# EAGLE design ControlBoard-v1.0 (EAGLE 8.5.2)
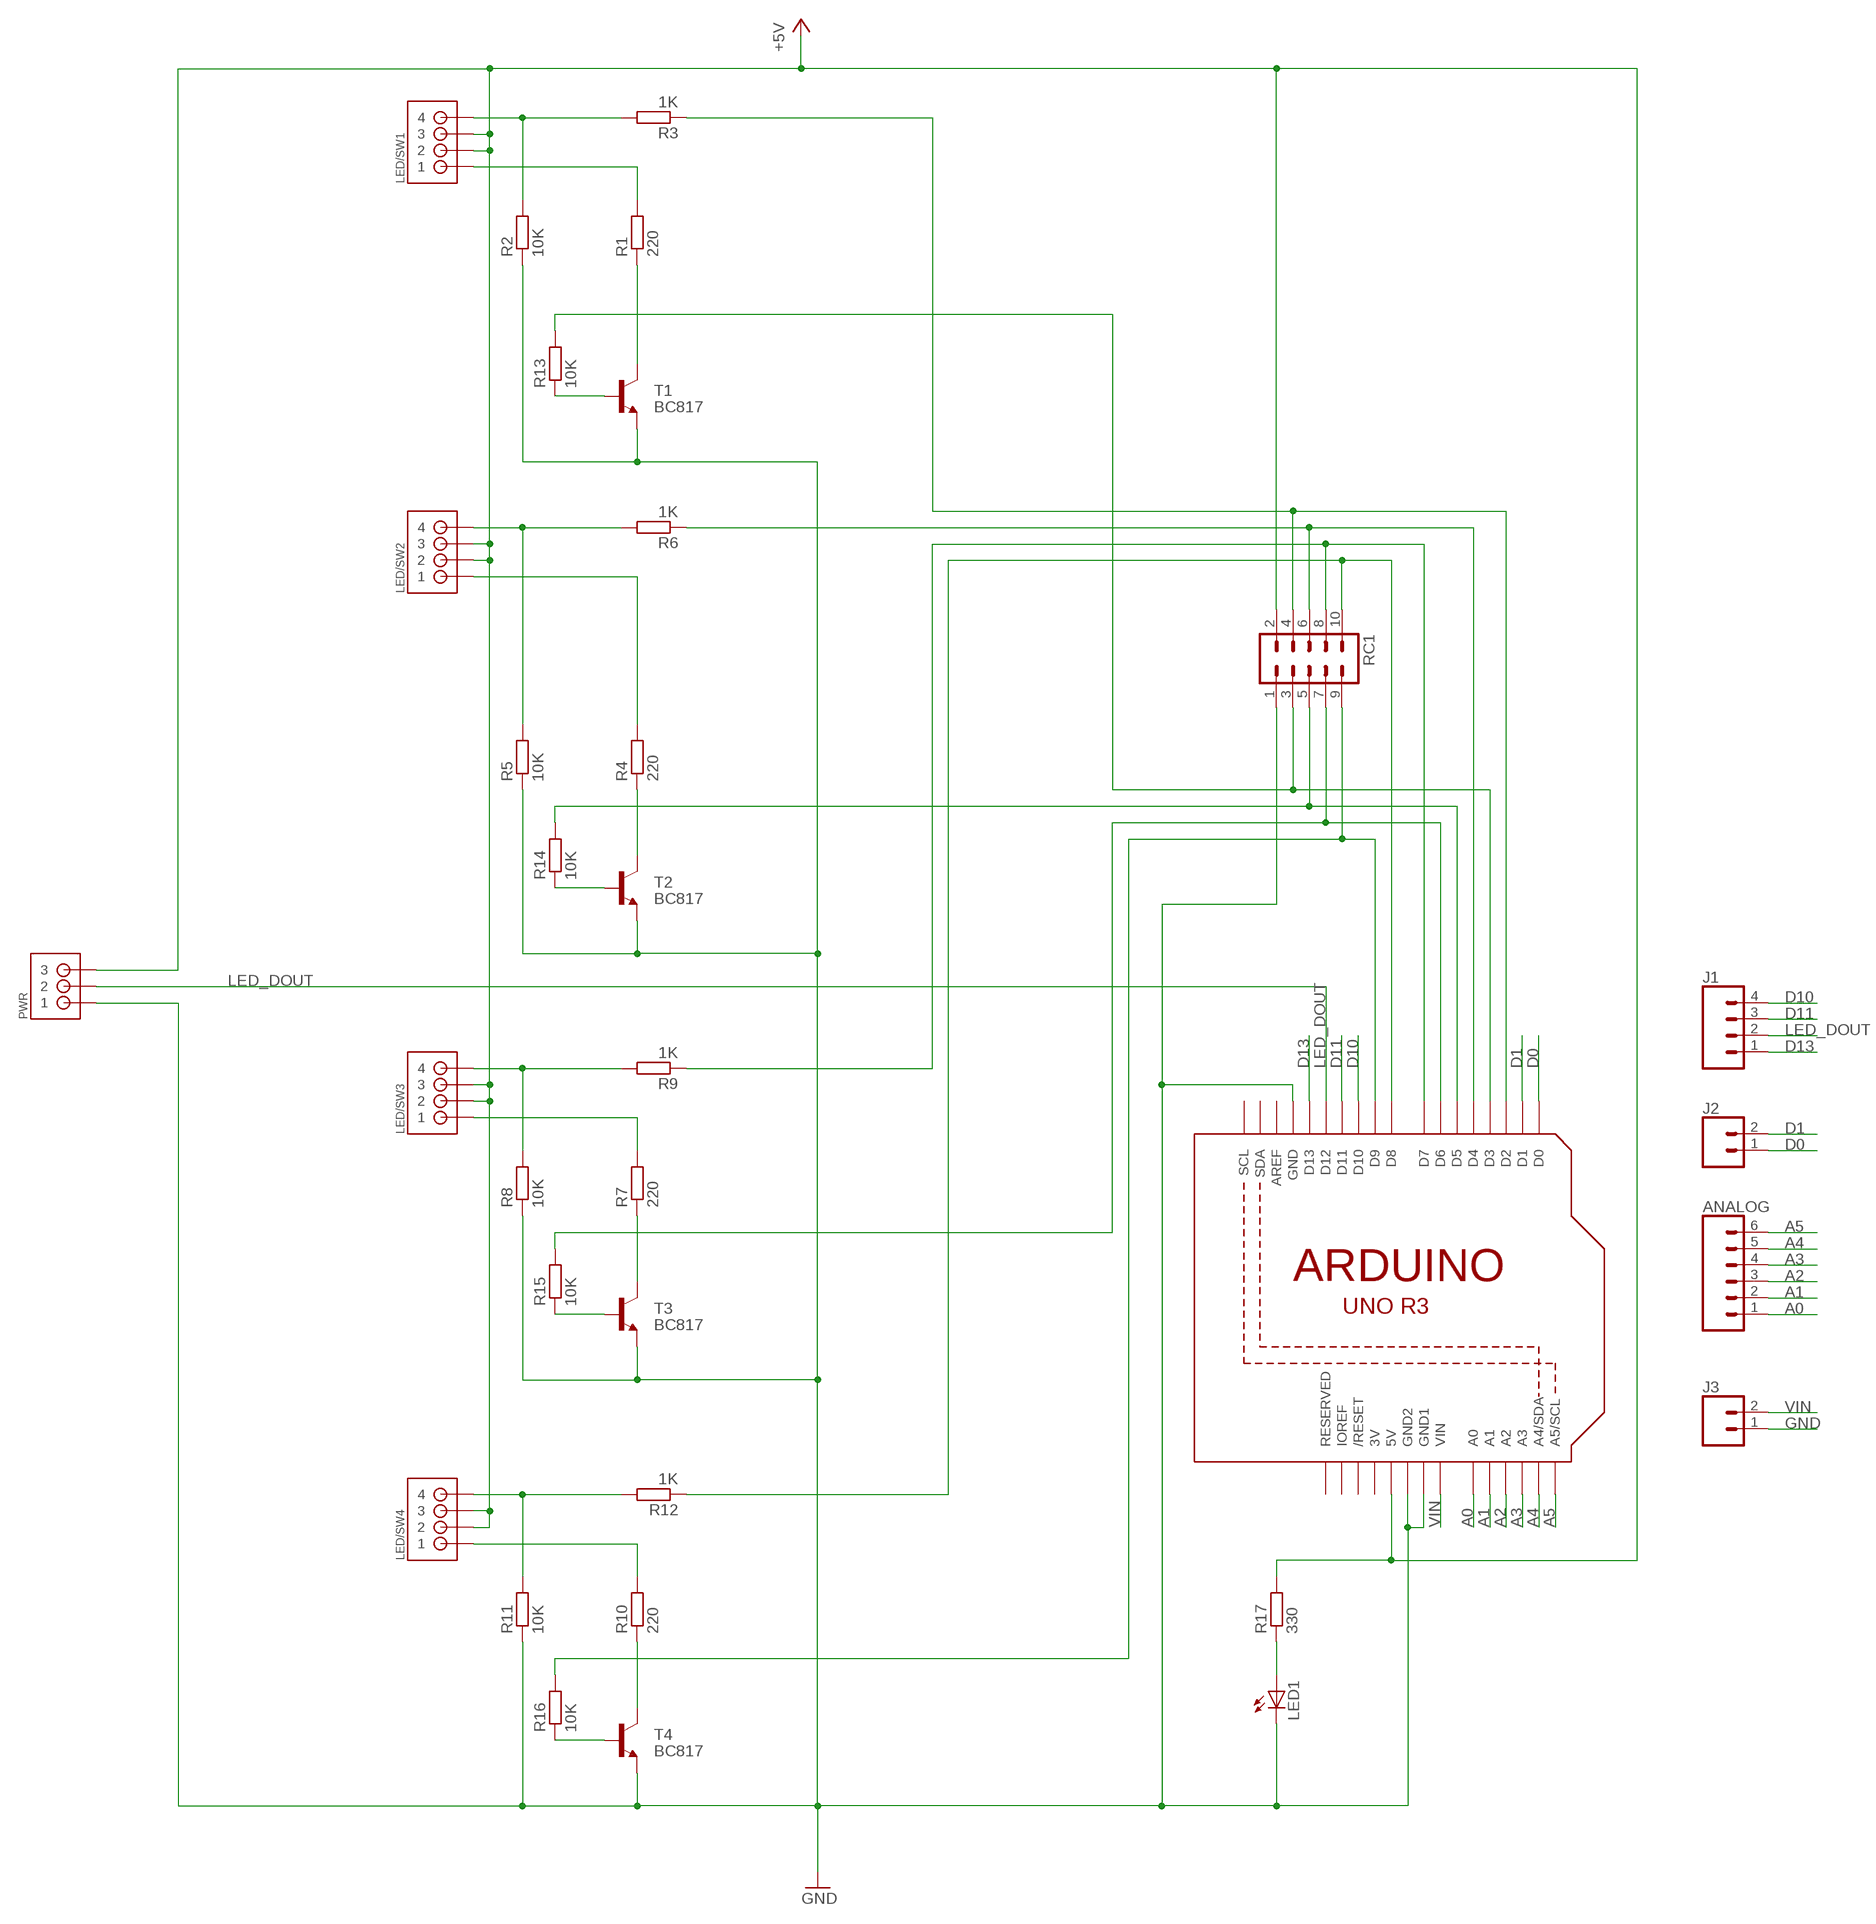
[diagram p0: schematic, sheet 1]

## Parts
ANALOG  CONN_06SILK_FEMALE_PTH  [1X06]
J1  CONN_04  [1X04]
J2  CONN_02  [1X02]
J3  CONN_02  [1X02]
LED1  LEDCHIPLED_0805  [CHIPLED_0805]
LED/SW1  JST-XA-04-PIN  [JST-XA-04]
LED/SW2  JST-XA-04-PIN  [JST-XA-04]
LED/SW3  JST-XA-04-PIN  [JST-XA-04]
LED/SW4  JST-XA-04-PIN  [JST-XA-04]
PWR  JST-XA-03-PIN  [JST-XA-03]
R1  220  RESISTORR0805  [R0805]
R2  10K  RESISTORR0805  [R0805]
R3  1K  RESISTORR0805  [R0805]
R4  220  RESISTORR0805  [R0805]
R5  10K  RESISTORR0805  [R0805]
R6  1K  RESISTORR0805  [R0805]
R7  220  RESISTORR0805  [R0805]
R8  10K  RESISTORR0805  [R0805]
R9  1K  RESISTORR0805  [R0805]
R10  220  RESISTORR0805  [R0805]
R11  10K  RESISTORR0805  [R0805]
R12  1K  RESISTORR0805  [R0805]
R13  10K  RESISTORR0805  [R0805]
R14  10K  RESISTORR0805  [R0805]
R15  10K  RESISTORR0805  [R0805]
R16  10K  RESISTORR0805  [R0805]
R17  330  RESISTORR0805  [R0805]
RC1  ML10  [ML10]
T1  BC817  [SOT23]
T2  BC817  [SOT23]
T3  BC817  [SOT23]
T4  BC817  [SOT23]
U1  ARDUINO-SHIELDLET  [ARDUINOR3-PINS]

## Nets
+5V: LED/SW1.2 LED/SW1.3 LED/SW2.2 LED/SW2.3 LED/SW3.2 LED/SW3.3 LED/SW4.2 LED/SW4.3 PWR.3 R17.2 RC1.2 U1.5V
A0: ANALOG.1 U1.A0
A1: ANALOG.2 U1.A1
A2: ANALOG.3 U1.A2
A3: ANALOG.4 U1.A3
A4: ANALOG.5 U1.A4(A4/SDA)
A5: ANALOG.6 U1.A5(A5/SCL)
D0: J2.1 U1.D0
D1: J2.2 U1.D1
D10: J1.4 U1.D10
D11: J1.3 U1.D11
D13: J1.1 U1.D13
GND: J3.1 LED1.C PWR.1 R2.1 R5.1 R8.1 R11.1 RC1.1 T1.2(E) T2.2(E) T3.2(E) T4.2(E) U1.GND U1.GND1 U1.GND2
LED_DOUT: J1.2 PWR.2 U1.D12
N$1: LED/SW1.1 R1.2
N$2: R1.1 T1.3(C)
N$3: LED/SW1.4 R2.2 R3.2
N$4: R3.1 RC1.4 U1.D2
N$5: R13.1 T1.1(B)
N$6: LED/SW2.1 R4.2
N$7: R4.1 T2.3(C)
N$8: LED/SW2.4 R5.2 R6.2
N$9: R6.1 RC1.6 U1.D4
N$10: R14.2 RC1.5 U1.D5
N$11: LED/SW3.1 R7.2
N$12: R7.1 T3.3(C)
N$13: LED/SW3.4 R8.2 R9.2
N$14: R9.1 RC1.8 U1.D7
N$15: R15.2 RC1.7 U1.D6
N$16: LED/SW4.1 R10.2
N$17: R10.1 T4.3(C)
N$18: LED/SW4.4 R11.2 R12.2
N$19: R12.1 RC1.10 U1.D8
N$20: R16.2 RC1.9 U1.D9
N$22: R14.1 T2.1(B)
N$23: R15.1 T3.1(B)
N$24: R16.1 T4.1(B)
N$26: LED1.A R17.1
N$27: R13.2 RC1.3 U1.D3
VIN: J3.2 U1.VIN
Unconnected: U1.AREF U1.IOREF U1.RESERVED U1.RESET(/RESET) U1.SCL U1.SDA

## Power pins joined to a net without a drawn wire
3V: U1.3V

## Library data of the parts
ANALOG = SparkFun-Connectors:CONN_06: Multi connection point. Often used as Generic Header-pin footprint for 0.1 inch spaced/style header connections On any of the 0.1 inch spaced packages, you can populate with these: Break Away Headers - Straight <https://www.sparkfun.com/products/116> (PRT-00116) Break Away Male Headers - Right Angle <https://www.sparkfun.com/products/553> (PRT-00553) Female Headers <https://www.sparkfun.com/products/115> (PRT-00115) Break Away Headers - Machine Pin <https://www.sparkfun.com/products/117> (PRT-00117) Break Away Female Headers - Swiss Machine Pin <https://www.sparkfun.com/products/743> (PRT-00743) Arduino Stackable Header - 6 Pin <https://www.sparkfun.com/products/9280> (PRT-09280) For SCREWTERMINALS and SPRING TERMINALS visit here: Screw Terimnals on SparkFun.com <https://www.sparkfun.com/search/results?term=Screw+Terminals> (5mm/3.5mm/2.54mm spacing) This device is also useful as a general connection point to wire up your design to another part of your project. Our various solder wires solder well into these plated through hole pads. Hook-Up Wire - Assortment (Stranded, 22 AWG) <https://www.sparkfun.com/products/11375> (PRT-11375) Hook-Up Wire - Assortment (Solid Core, 22 AWG) <https://www.sparkfun.com/products/11367> (PRT-11367) View the entire wire category on our website here <https://www.sparkfun.com/categories/141>; PROD_ID: CONN-08437
J1 = SparkFun-Connectors:CONN_04: Multi connection point. Often used as Generic Header-pin footprint for 0.1 inch spaced/style header connections On any of the 0.1 inch spaced packages, you can populate with these: Break Away Headers - Straight <https://www.sparkfun.com/products/116> (PRT-00116) Break Away Male Headers - Right Angle <https://www.sparkfun.com/products/553> (PRT-00553) Female Headers <https://www.sparkfun.com/products/115> (PRT-00115) Break Away Headers - Machine Pin <https://www.sparkfun.com/products/117> (PRT-00117) Break Away Female Headers - Swiss Machine Pin <https://www.sparkfun.com/products/743> (PRT-00743) For SCREWTERMINALS and SPRING TERMINALS visit here: Screw Terimnals on SparkFun.com <https://www.sparkfun.com/search/results?term=Screw+Terminals> (5mm/3.5mm/2.54mm spacing) This device is also useful as a general connection point to wire up your design to another part of your project. Our various solder wires solder well into these plated through hole pads. Hook-Up Wire - Assortment (Stranded, 22 AWG) <https://www.sparkfun.com/products/11375> (PRT-11375) Hook-Up Wire - Assortment (Solid Core, 22 AWG) <https://www.sparkfun.com/products/11367> (PRT-11367) View the entire wire category on our website here <https://www.sparkfun.com/categories/141> Special notes: Molex polarized connector foot print use with SKU : PRT-08231 with associated crimp pins and housings. 1MM SMD Version SKU: PRT-10208; PROD_ID: CONN-09696
J2 J3 = SparkFun-Connectors:CONN_02: Multi connection point. Often used as Generic Header-pin footprint for 0.1 inch spaced/style header connections On any of the 0.1 inch spaced packages, you can populate with these: Break Away Headers - Straight <https://www.sparkfun.com/products/116> (PRT-00116) Break Away Male Headers - Right Angle <https://www.sparkfun.com/products/553> (PRT-00553) Female Headers <https://www.sparkfun.com/products/115> (PRT-00115) Break Away Headers - Machine Pin <https://www.sparkfun.com/products/117> (PRT-00117) Break Away Female Headers - Swiss Machine Pin <https://www.sparkfun.com/products/743> (PRT-00743) For SCREWTERMINALS and SPRING TERMINALS visit here: Screw Terimnals on SparkFun.com <https://www.sparkfun.com/search/results?term=Screw+Terminals> (5mm/3.5mm/2.54mm spacing) This device is also useful as a general connection point to wire up your design to another part of your project. Our various solder wires solder well into these plated through hole pads. Hook-Up Wire - Assortment (Stranded, 22 AWG) <https://www.sparkfun.com/products/11375> (PRT-11375) Hook-Up Wire - Assortment (Solid Core, 22 AWG) <https://www.sparkfun.com/products/11367> (PRT-11367) View the entire wire category on our website here <https://www.sparkfun.com/categories/141> Special notes: Molex polarized connector foot print use with: PRT-08233 with associated crimp pins and housings. 2.54_SCREWTERM for use with PRT-10571. 3.5mm Screw Terminal footprints for PRT-08084 5mm Screw Terminal footprints for use with PRT-08432
LED1 = adafruit:LED: LED OSRAM: - CHIPLED LG R971, LG N971, LY N971, LG Q971, LY Q971, LO R971, LY R971 LH N974, LH R974 LS Q976, LO Q976, LY Q976 LO Q996 - Hyper CHIPLED LW Q18S LB Q993, LB Q99A, LB R99A - SideLED LS A670, LO A670, LY A670, LG A670, LP A670 LB A673, LV A673, LT A673, LW A673 LH A674 LY A675 LS A676, LA A676, LO A676, LY A676, LW A676 LS A679, LY A679, LG A679 - Hyper Micro SIDELED® LS Y876, LA Y876, LO Y876, LY Y876 LT Y87S - SmartLED LW L88C, LW L88S LB L89C, LB L89S, LG L890 LS L89K, LO L89K, LY L89K LS L896, LA L896, LO L896, LY L896 - TOPLED LS T670, LO T670, LY T670, LG T670, LP T670 LSG T670, LSP T670, LSY T670, LOP T670, LYG T670 LG T671, LOG T671, LSG T671 LB T673, LV T673, LT T673, LW T673 LH T674 LS T676, LA T676, LO T676, LY T676, LB T676, LH T676, LSB T676, LW T676 LB T67C, LV T67C, LT T67C, LS T67K, LO T67K, LY T67K, LW E67C LS E67B, LA E67B, LO E67B, LY E67B, LB E67C, LV E67C, LT E67C LW T67C LS T679, LY T679, LG T679 LS T770, LO T770, LY T770, LG T770, LP T770 LB T773, LV T773, LT T773, LW T773 LH T774 LS E675, LA E675, LY E675, LS T675 LS T776, LA T776, LO T776, LY T776, LB T776 LHGB T686 LT T68C, LB T68C - Hyper Mini TOPLED® LB M676 - Mini TOPLED Santana® LG M470 LS M47K, LO M47K, LY M47K Source: http://www.osram.convergy.de/
LED/SW1-LED/SW4 = abw:JST-XA-04-PIN
PWR = abw:JST-XA-03-PIN: JST XA Connector 3 Pin Wire to board connector. Pitch: 2.54 mm, (0.100") Number of pins: 3
R1-R17 = abw:RESISTOR: RESISTOR, European symbol
RC1 = con-harting-ml:ML10: HARTING; OC_FARNELL: unknown; OC_NEWARK: unknown
T1-T4 = abw:BC817: General purpose NPN transistor SMD
U1 = abw:ARDUINO-SHIELDLET

## Board
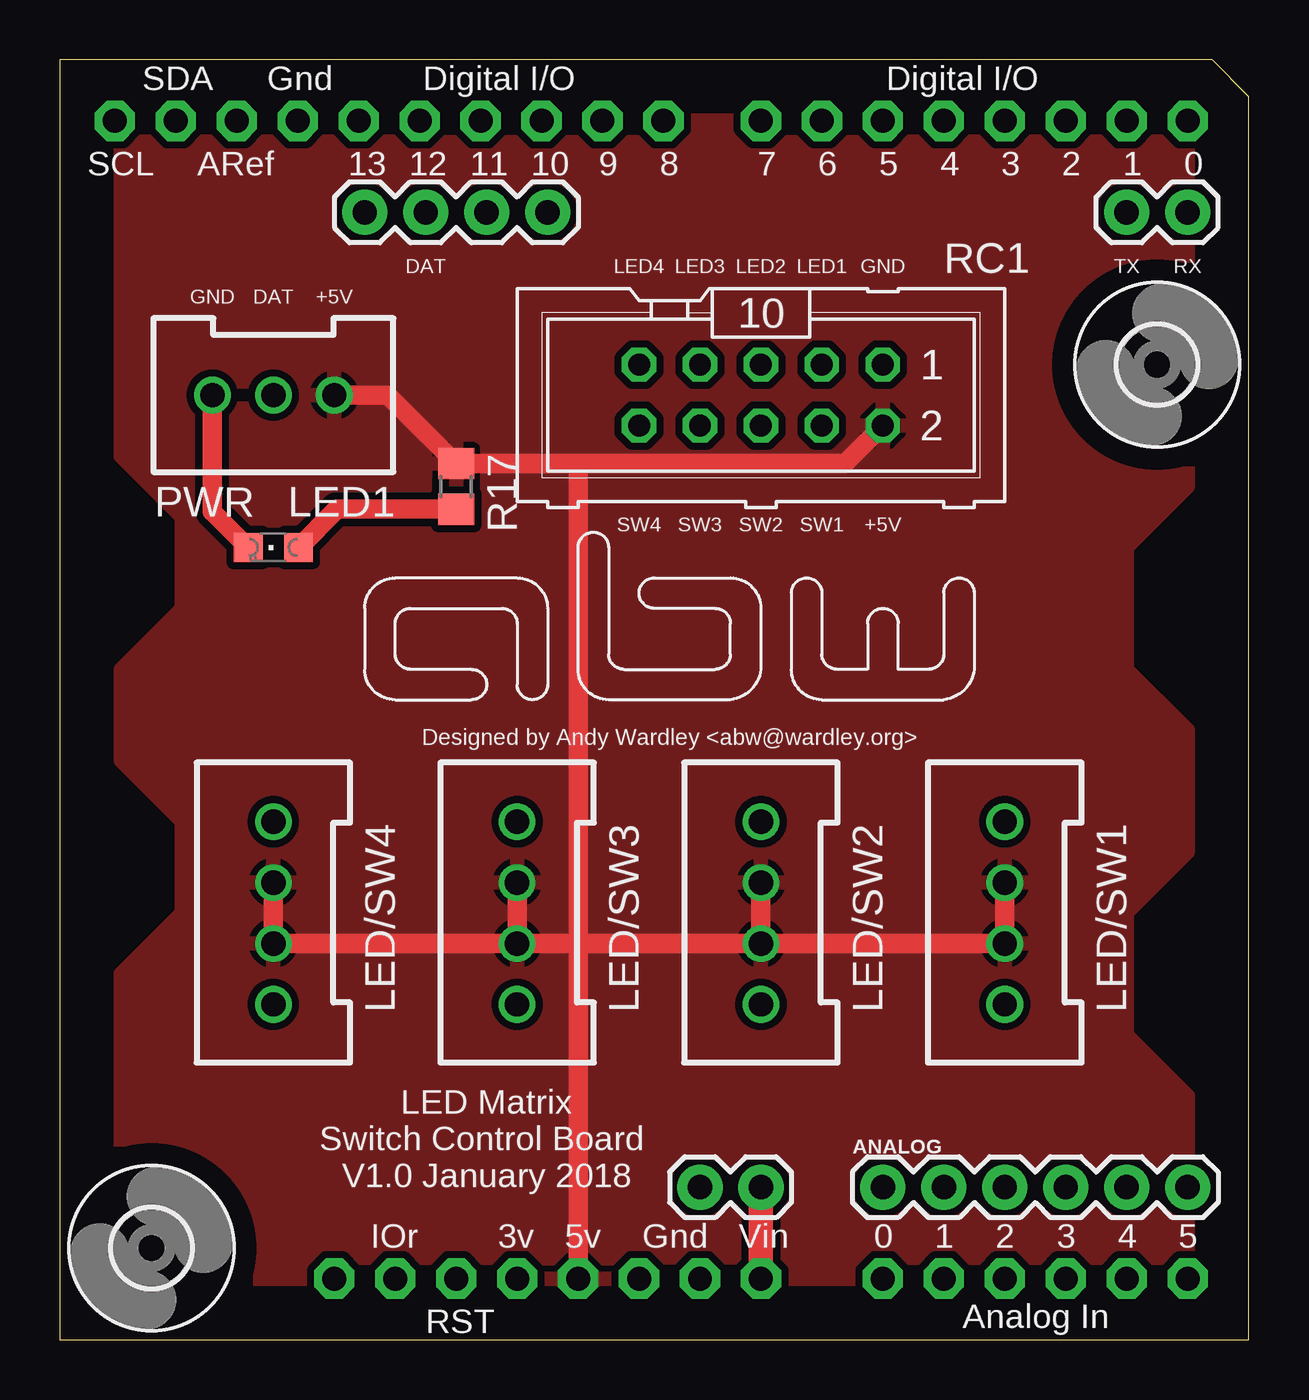
[diagram p1: board, top side]
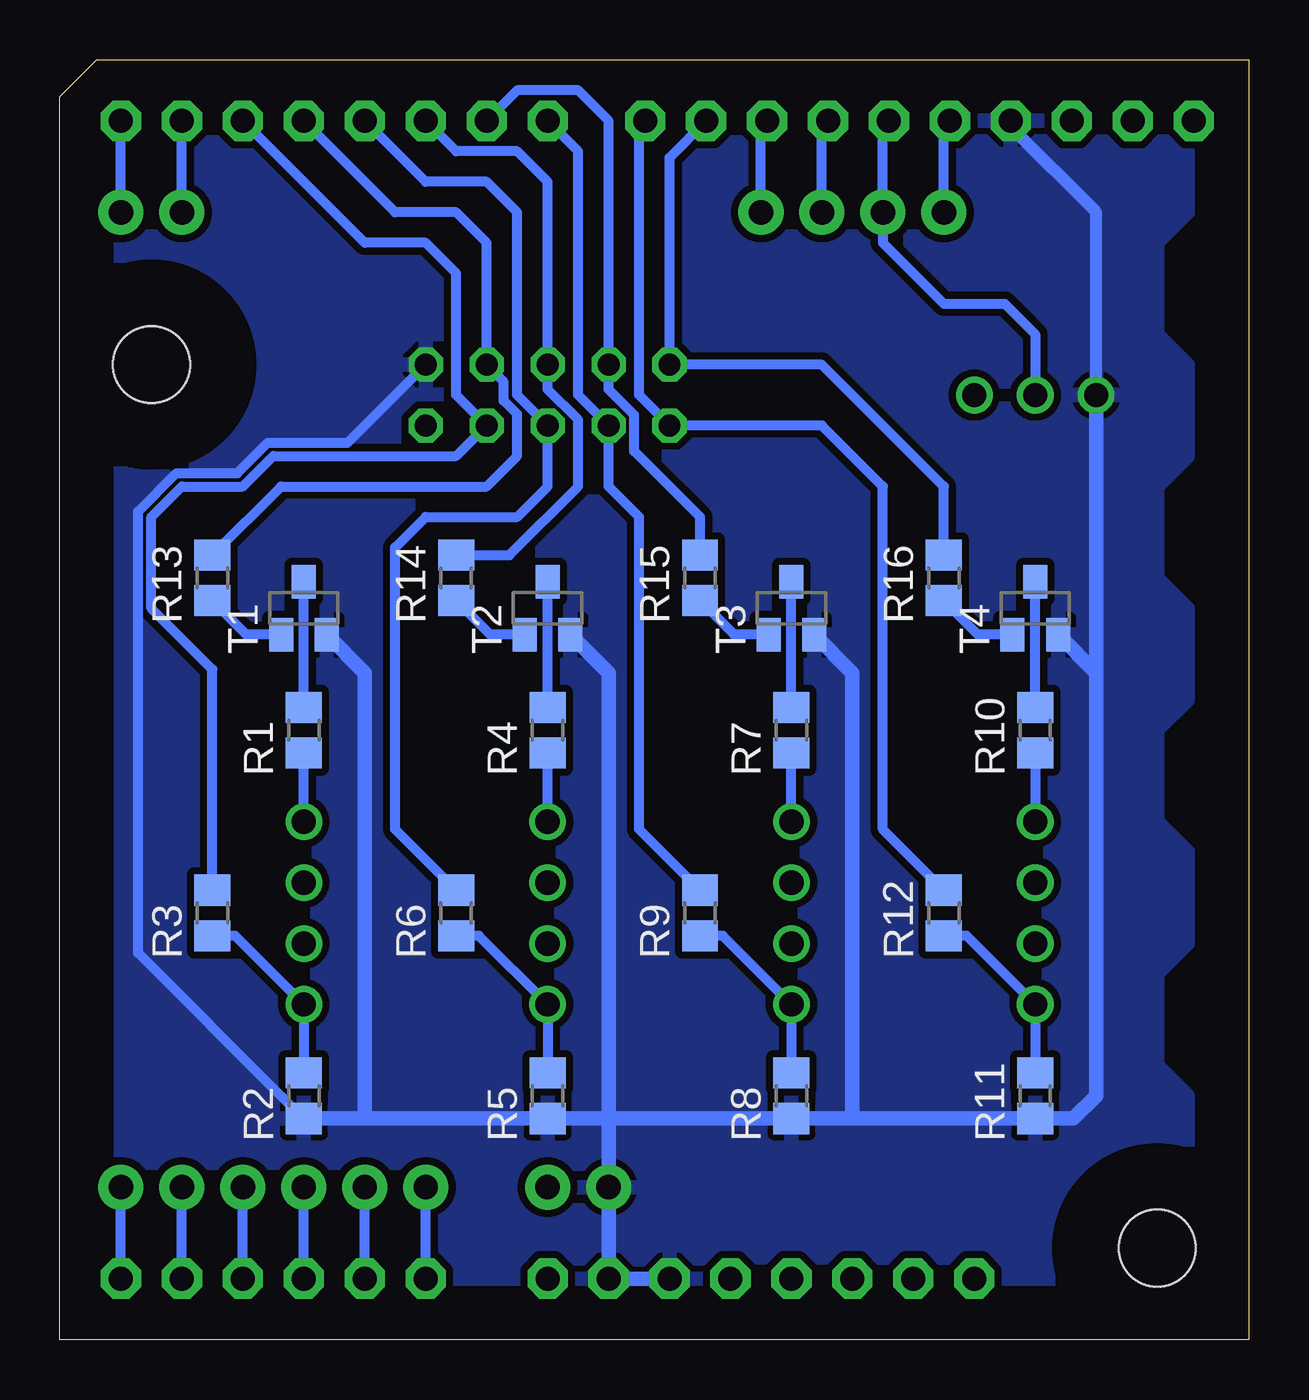
[diagram p2: board, bottom side, seen from below]

Size 49.53 x 53.34 mm. Coordinates in mm from the lower left corner, seen from the top.
Outline: 49.2,0 0,0 0,53.33
Copper layers (1*16): Top 0.035mm / dielectric 1.5mm / Bottom 0.035mm
Design rules "default": minimum track width 6mil, minimum drill 0.35mm, track to track 6mil, track to pad 6mil, pad to pad 6mil, via to via 6mil, smd to smd 6mil, copper to edge 40mil, drill to drill 6mil, minimum pad ring 10mil, minimum via ring 8mil, stop-mask expansion 4mil, vias tented up to drill 0mil, thermal gap 10mil

### Footprints (pad centres in the part's own frame; a part is rotated, then mirrored left to right if it is on the bottom)
1X06 = drill 1.016 pad 1.88: 1 0,0; 2 2.54,0; 3 5.08,0; 4 7.62,0; 5 10.16,0; 6 12.7,0
1X04 = drill 1.016 pad 1.88: 1 0,0; 2 2.54,0; 3 5.08,0; 4 7.62,0
1X02 = drill 1.016 pad 1.88: 1 0,0; 2 2.54,0
CHIPLED_0805 = smd 1.2 x 1.2: A 0,-1.05; C 0,1.05
JST-XA-04 = drill 1.016: 1 -2.54,0; 2 0,0; 3 2.54,0; 4 5.08,0
JST-XA-03 = drill 1.016: 1 -2.54,0; 2 0,0; 3 2.54,0
R0805 = smd 1.3 x 1.5: 1 -0.95,0; 2 0.95,0
ML10 = drill 0.914 octagon: 1 -5.08,-1.27; 2 -5.08,1.27; 3 -2.54,-1.27; 4 -2.54,1.27; 5 0,-1.27; 6 0,1.27; 7 2.54,-1.27; 8 2.54,1.27; 9 5.08,-1.27; 10 5.08,1.27
SOT23 = smd 1 x 1.4: 1 -0.95,-1.1; 2 0.95,-1.1; 3 0,1.1
ARDUINOR3-PINS = drill 1 pad 1.676 octagon: 3V 19.05,2.54; 5V 21.59,2.54; A0 34.29,2.54; A1 36.83,2.54; A2 39.37,2.54; A3 41.91,2.54; A4 44.45,2.54; A5 46.99,2.54; AREF 7.366,50.8; D0 46.99,50.8; D1 44.45,50.8; D2 41.91,50.8; D3 39.37,50.8; D4 36.83,50.8; D5 34.29,50.8; D6 31.75,50.8; D7 29.21,50.8; D8 25.146,50.8; D9 22.606,50.8; D10 20.066,50.8; D11 17.526,50.8; D12 14.986,50.8; D13 12.446,50.8; GND 9.906,50.8; GND1 26.67,2.54; GND2 24.13,2.54; IOREF 13.97,2.54; RESERVED 11.43,2.54; RESET 16.51,2.54; SCL 2.286,50.8; SDA 4.826,50.8; VIN 29.21,2.54
3,2 = hole 3.2: 0,0

### Placement (x,y rotation side)
ANALOG  34.29,6.35 0 top
J1  12.7,46.99 0 top
J2  46.99,46.99 180 top
J3  26.67,6.35 0 top
LED1  8.89,33.02 90 top
LED/SW1  39.37,19.05 270 top
LED/SW2  29.21,19.05 270 top
LED/SW3  19.05,19.05 270 top
LED/SW4  8.89,19.05 270 top
PWR  8.89,39.37 0 top
R1  39.37,25.4 270 bottom
R2  39.37,10.16 90 bottom
R3  43.18,17.78 270 bottom
R4  29.21,25.4 270 bottom
R5  29.21,10.16 90 bottom
R6  33.02,17.78 270 bottom
R7  19.05,25.4 270 bottom
R8  19.05,10.16 90 bottom
R9  22.86,17.78 270 bottom
R10  8.89,25.4 270 bottom
R11  8.89,10.16 90 bottom
R12  12.7,17.78 270 bottom
R13  43.18,31.75 90 bottom
R14  33.02,31.75 90 bottom
R15  22.86,31.75 90 bottom
R16  12.7,31.75 90 bottom
R17  16.51,35.56 90 top
RC1  29.21,39.37 180 top
T1  39.37,30.48 0 bottom
T2  29.21,30.48 0 bottom
T3  19.05,30.48 0 bottom
T4  8.89,30.48 0 bottom
U1  0,0 0 top
U$2  [3,2]  3.81,3.81 0 top
U$3  [3,2]  45.72,40.64 0 top
U$4  [ABWLOGO-TINY]  25.4,29.21 0 top

### Tracks (layer width: path | path; a pad name or v marks a point on that pad's centre or on a via)
+5V
  Top 0.813: LED/SW2.3 21.59,16.51 | 21.59,16.51 LED/SW3.3 | LED/SW3.3 LED/SW4.3 LED/SW4.2 | LED/SW2.3 LED/SW1.3 LED/SW1.2 | LED/SW3.3 LED/SW3.2 | LED/SW2.3 LED/SW2.2 | U1.5V 21.59,8.89 21.59,16.51 | PWR.3 13.65,39.37 R17.2 21.59,36.51 | 21.59,36.51 32.7,36.51 RC1.2 | 21.59,16.51 21.59,36.51
  pour Top (isolate 0.305): 2.54,50.8 46.99,50.8 46.99,35.56 44.45,33.02 44.45,27.94 46.99,25.4 46.99,20.32 44.45,17.78 44.45,12.7 46.99,10.16 46.99,2.54 2.54,2.54 2.54,15.24 5.08,17.78 5.08,21.59 2.54,24.13 2.54,27.94 5.08,30.48 5.08,34.29 2.54,36.83
A0
  Bottom 0.406: U1.A0 ANALOG.1
A1
  Bottom 0.406: U1.A1 ANALOG.2
A2
  Bottom 0.406: U1.A2 ANALOG.3
A3
  Bottom 0.406: U1.A3 ANALOG.4
A4
  Bottom 0.406: U1.A4 ANALOG.5
A5
  Bottom 0.406: U1.A5 ANALOG.6
D0
  Bottom 0.406: J2.1 U1.D0
D1
  Bottom 0.406: J2.2 U1.D1
D10
  Bottom 0.406: J1.4 20.32,50.55 U1.D10
D11
  Bottom 0.406: J1.3 17.78,50.55 U1.D11
D13
  Bottom 0.406: J1.1 12.7,50.55 U1.D13
GND
  Top 0.813: LED1.C 6.35,34.51 PWR.1
  Bottom 0.406: RC1.1 37.54,37.39 40.87,37.39 42.14,36.12 44.68,36.12 46.28,34.52 46.28,16.12 40.27,10.1 40.26,10.1 R2.1
  Bottom 0.508: PWR.1 6.35,46.99 9.91,50.55 U1.GND
  Bottom 0.61: R2.1 36.83,9.21 | 36.83,9.21 R5.1 26.67,9.21 | 26.67,9.21 R8.1 16.51,9.21 | 16.51,9.21 R11.1 7.3,9.21 6.35,10.16 6.35,27.79 | T1.2 36.83,27.79 36.83,9.21 | T2.2 26.67,27.79 26.67,9.21 | T3.2 16.51,27.79 16.51,9.21 | 6.35,27.79 T4.2 | U1.GND2 U1.GND1 J3.1 26.67,9.21 | 6.35,27.79 PWR.1
  pour Bottom (isolate 0.305): 2.54,50.8 46.99,50.8 46.99,2.54 2.54,2.54 2.54,10.16 3.81,11.43 3.81,15.24 2.54,16.51 2.54,20.32 3.81,21.59 3.81,25.4 2.54,26.67 2.54,30.48 3.81,31.75 3.81,35.56 2.54,36.83 2.54,40.64 3.81,41.91 3.81,45.72 2.54,46.99
LED_DOUT
  Bottom 0.406: U1.D12 15.24,50.55 J1.2 15.24,45.72 12.7,43.18 10.16,43.18 8.89,41.91 PWR.2
N$1
  Bottom 0.406: LED/SW1.1 R1.2
N$2
  Bottom 0.406: R1.1 T1.3
N$3
  Bottom 0.406: R2.2 LED/SW1.4 42.23,16.83 R3.2
N$4
  Bottom 0.406: U1.D2 36.83,45.72 34.29,45.72 33.02,44.45 33.02,39.37 RC1.4 33.02,36.83 40.64,36.83 41.91,35.56 44.45,35.56 45.72,34.29 45.72,30.48 43.18,27.94 R3.1
N$5
  Bottom 0.406: T1.1 41.76,29.38 R13.1
N$6
  Bottom 0.406: LED/SW2.1 R4.2
N$7
  Bottom 0.406: R4.1 T2.3
N$8
  Bottom 0.406: R5.2 LED/SW2.4 32.07,16.83 R6.2
N$9
  Bottom 0.406: U1.D4 34.29,48.26 31.75,48.26 30.48,46.99 30.48,39.37 RC1.6 29.21,35.56 30.48,34.29 34.29,34.29 35.56,33.02 35.56,21.27 R6.1
N$10
  Bottom 0.406: U1.D5 33.02,49.53 30.48,49.53 29.21,48.26 RC1.5 29.21,39.61 27.94,38.34 27.94,35.56 30.8,32.7 R14.2
N$11
  Bottom 0.406: LED/SW3.1 R7.2
N$12
  Bottom 0.406: R7.1 T3.3
N$13
  Bottom 0.406: R8.2 LED/SW3.4 21.91,16.83 R9.2
N$14
  Bottom 0.406: U1.D7 27.94,49.53 27.94,39.37 RC1.8 26.67,35.56 25.4,34.29 25.4,21.27 R9.1
N$15
  Bottom 0.406: U1.D6 30.48,52.07 27.94,52.07 26.67,50.8 RC1.7 26.67,39.61 25.6,38.54 25.6,37.03 22.86,34.29 R15.2
N$16
  Bottom 0.406: R10.2 LED/SW4.1
N$17
  Bottom 0.406: R10.1 T4.3
N$18
  Bottom 0.406: R11.2 LED/SW4.4 11.75,16.83 R12.2
N$19
  Bottom 0.406: U1.D8 25.4,50.55 25.4,39.37 RC1.10 17.78,38.1 15.24,35.56 15.24,21.27 R12.1
N$20
  Bottom 0.406: U1.D9 24.13,49.28 RC1.9 17.78,40.64 12.7,35.56 R16.2
N$22
  Bottom 0.406: T2.1 31.6,29.38 R14.1
N$23
  Bottom 0.406: T3.1 21.44,29.38 R15.1
N$24
  Bottom 0.406: T4.1 11.28,29.38 R16.1
N$26
  Top 0.813: LED1.A 11.53,34.61 R17.1
N$27
  Bottom 0.406: U1.D3 35.56,46.99 33.02,46.99 31.75,45.72 RC1.3 31.04,39.93 31.04,39.14 30.48,38.58 30.48,36.83 31.75,35.56 40.32,35.56 R13.2
VIN
  Top 1.016: J3.2 U1.VIN

### Text on the board
tNames: DAT | LED4 | LED3 | LED2 | LED1 | GND | TX | RX | GND | DAT | +5V | SW4 | SW3 | SW2 | SW1 | +5V | LED Matrix / Switch Control Board / V1.0 January 2018